# Altium schematic sheet MSP_Telemetry.SchDoc
size A4; Organization: Creotech Instruments; Address1: Gen. L. Okulickiego 7/9; Address2: 05-500 Piaseczno; Address3: Poland
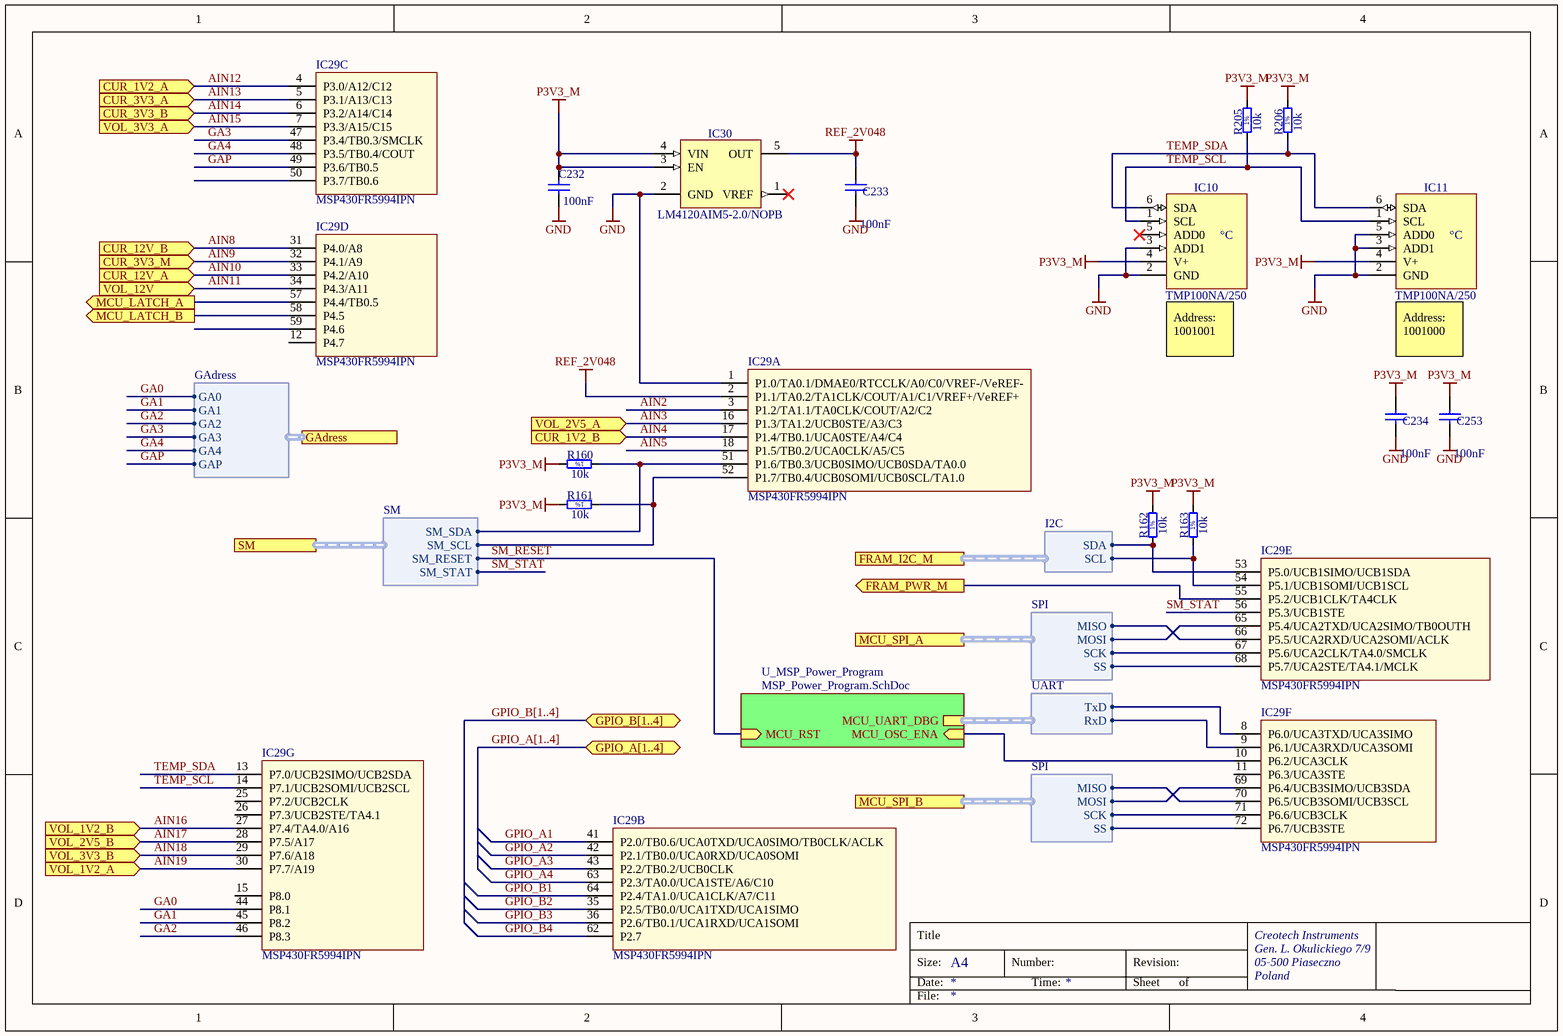
[diagram p0: MSP_Telemetry.SchDoc]

## Parts
C232  100nF  [CAPC1608X87N]
C233  100nF  [CAPC1608X87N]
C234  100nF  [CAPC1608X87N]
C253  100nF  [CAPC1608X87N]
IC10  TMP100NA/250  [SOT95P280X145-6N]
IC11  TMP100NA/250  [SOT95P280X145-6N]
IC29  MSP430FR5994IPN  [PQFP50P1400X1400-80N]  (parts A,B,C,D,E,F,G of 9)
IC30  LM4120AIM5-2.0/NOPB  [SOT95P280X145-5N]
R160  10k  [RESC1608X55N]
R161  10k  [RESC1608X55N]
R162  10k  [RESC1608X55N]
R163  10k  [RESC1608X55N]
R205  10k  [RESC1608X55N]
R206  10k  [RESC1608X55N]

## Sub-sheets
U_MSP_Power_Program = MSP_Power_Program.SchDoc: MCU_OSC_ENA (in), MCU_UART_DBG (harness UART), MCU_RST (in)

## Ports
CUR_1V2_A (in), CUR_1V2_B (in), CUR_3V3_A (in), CUR_3V3_B (in), CUR_3V3_M (in), CUR_12V_A (in), CUR_12V_B (in), FRAM_I2C_M (harness I2C), FRAM_PWR_M (out), GAdress (harness GAdress), GPIO_A[1..4] (bidir), GPIO_B[1..4] (bidir), MCU_LATCH_A (out), MCU_LATCH_B (out), MCU_SPI_A (harness SPI), MCU_SPI_B (harness SPI), SM (harness SM), VOL_1V2_A (in), VOL_1V2_B (in), VOL_2V5_A (in), VOL_2V5_B (in), VOL_3V3_A (in), VOL_3V3_B (in), VOL_12V (in)

## Harnesses
I2C: SDA, SCL
SPI: MISO, MOSI, SCK, SS
UART: TxD, RxD
SM: SM_SCL, SM_SDA, SM_RESET, SM_STAT
GAdress: GA0, GA1, GA2, GA3, GA4, GAP

## Nets
GND: C232.1 C233.1 C234.1 C253.1 IC10.2(GND) IC10.3(ADD1) IC11.2(GND) IC11.3(ADD1) IC11.5(ADD0) IC29.1(P1.0/TA0.1/DMAE0/RTCCLK/A0/C0/VREF-/VeREF-) IC30.2(GND)
P3V3_M: C232.2 C234.2 C253.2 IC10.4(V+) IC11.4(V+) IC30.3(EN) IC30.4(VIN) R160.2 R161.2 R162.2 R163.2 R205.2 R206.2
REF_2V048: C233.2 IC29.2(P1.1/TA0.2/TA1CLK/COUT/A1/C1/VREF+/VeREF+) IC30.5(OUT)
AIN2: IC29.3(P1.2/TA1.1/TA0CLK/COUT/A2/C2)
AIN3: IC29.16(P1.3/TA1.2/UCB0STE/A3/C3) ; port VOL_2V5_A
AIN4: IC29.17(P1.4/TB0.1/UCA0STE/A4/C4) ; port CUR_1V2_B
AIN5: IC29.18(P1.5/TB0.2/UCA0CLK/A5/C5)
AIN8: IC29.31(P4.0/A8) ; port CUR_12V_B
AIN9: IC29.32(P4.1/A9) ; port CUR_3V3_M
AIN10: IC29.33(P4.2/A10) ; port CUR_12V_A
AIN11: IC29.34(P4.3/A11) ; port VOL_12V
AIN12: IC29.4(P3.0/A12/C12) ; port CUR_1V2_A
AIN13: IC29.5(P3.1/A13/C13) ; port CUR_3V3_A
AIN14: IC29.6(P3.2/A14/C14) ; port CUR_3V3_B
AIN15: IC29.7(P3.3/A15/C15) ; port VOL_3V3_A
AIN16: IC29.27(P7.4/TA4.0/A16) ; port VOL_1V2_B
AIN17: IC29.28(P7.5/A17) ; port VOL_2V5_B
AIN18: IC29.29(P7.6/A18) ; port VOL_3V3_B
AIN19: IC29.30(P7.7/A19) ; port VOL_1V2_A
FRAM_PWR_M: IC29.55(P5.2/UCB1CLK/TA4CLK) ; port FRAM_PWR_M
GA0: IC29.44(P8.1) ; port GAdress.GA0
GA1: IC29.45(P8.2) ; port GAdress.GA1
GA2: IC29.46(P8.3) ; port GAdress.GA2
GA3: IC29.47(P3.4/TB0.3/SMCLK) ; port GAdress.GA3
GA4: IC29.48(P3.5/TB0.4/COUT) ; port GAdress.GA4
GAP: IC29.49(P3.6/TB0.5) ; port GAdress.GAP
GPIO_A1: IC29.41(P2.0/TB0.6/UCA0TXD/UCA0SIMO/TB0CLK/ACLK)
GPIO_A2: IC29.42(P2.1/TB0.0/UCA0RXD/UCA0SOMI)
GPIO_A3: IC29.43(P2.2/TB0.2/UCB0CLK)
GPIO_A4: IC29.63(P2.3/TA0.0/UCA1STE/A6/C10)
GPIO_B1: IC29.64(P2.4/TA1.0/UCA1CLK/A7/C11)
GPIO_B2: IC29.35(P2.5/TB0.0/UCA1TXD/UCA1SIMO)
GPIO_B3: IC29.36(P2.6/TB0.1/UCA1RXD/UCA1SOMI)
GPIO_B4: IC29.62(P2.7)
MCU_LATCH_A: IC29.57(P4.4/TB0.5) ; port MCU_LATCH_A
MCU_LATCH_B: IC29.58(P4.5) ; port MCU_LATCH_B
SM_RESET: sheet U_MSP_Power_Program/MCU_RST, port SM.SM_RESET
SM_STAT: IC29.56(P5.3/UCB1STE) ; port SM.SM_STAT
TEMP_SCL: IC10.1(SCL) IC11.1(SCL) IC29.14(P7.1/UCB2SOMI/UCB2SCL) R205.1
TEMP_SDA: IC10.6(SDA) IC11.6(SDA) IC29.13(P7.0/UCB2SIMO/UCB2SDA) R206.1
NetIC29_8: IC29.8(P6.0/UCA3TXD/UCA3SIMO) ; sheet U_MSP_Power_Program/MCU_UART_DBG.TxD
NetIC29_9: IC29.9(P6.1/UCA3RXD/UCA3SOMI) ; sheet U_MSP_Power_Program/MCU_UART_DBG.RxD
NetIC29_10: IC29.10(P6.2/UCA3CLK) ; sheet U_MSP_Power_Program/MCU_OSC_ENA
NetIC29_51: IC29.51(P1.6/TB0.3/UCB0SIMO/UCB0SDA/TA0.0) R160.1 ; port SM.SM_SDA
NetIC29_52: IC29.52(P1.7/TB0.4/UCB0SOMI/UCB0SCL/TA1.0) R161.1 ; port SM.SM_SCL
NetIC29_53: IC29.53(P5.0/UCB1SIMO/UCB1SDA) R162.1 ; port FRAM_I2C_M.SDA
NetIC29_54: IC29.54(P5.1/UCB1SOMI/UCB1SCL) R163.1 ; port FRAM_I2C_M.SCL
NetIC29_65: IC29.65(P5.4/UCA2TXD/UCA2SIMO/TB0OUTH) ; port MCU_SPI_A.MOSI
NetIC29_66: IC29.66(P5.5/UCA2RXD/UCA2SOMI/ACLK) ; port MCU_SPI_A.MISO
NetIC29_67: IC29.67(P5.6/UCA2CLK/TA4.0/SMCLK) ; port MCU_SPI_A.SCK
NetIC29_68: IC29.68(P5.7/UCA2STE/TA4.1/MCLK) ; port MCU_SPI_A.SS
NetIC29_69: IC29.69(P6.4/UCB3SIMO/UCB3SDA) ; port MCU_SPI_B.MOSI
NetIC29_70: IC29.70(P6.5/UCB3SOMI/UCB3SCL) ; port MCU_SPI_B.MISO
NetIC29_71: IC29.71(P6.6/UCB3CLK) ; port MCU_SPI_B.SCK
NetIC29_72: IC29.72(P6.7/UCB3STE) ; port MCU_SPI_B.SS

Not connected (* = marked no-connect by the designer): IC10 5(ADD0)*; IC29 11(P6.3/UCA3STE) 12(P4.7) 15(P8.0) 25(P7.2/UCB2CLK) 26(P7.3/UCB2STE/TA4.1) 50(P3.7/TB0.6) 59(P4.6); IC30 1(VREF)*

## Buses and harness runs
bus GPIO_A[1..4] = port GPIO_A[1..4]
bus GPIO_B[1..4] = port GPIO_B[1..4]

## Notes on the sheet
- (near IC10) Address: 1001001
- (near IC11) Address: 1001000
- Title
- Size:
- Date:
- A4
- Number:
- Time:
- Revision:
- Sheet
- of
- File:
- (in symbol R0603_10K_1%_0.1W_100PPM) 1%
- (in symbol TMP100NA/250) °C

## Library data of the parts
C232-C234 C253 = CC0603_100NF_50V_10%_X7R: Non-polarised capacitor; Part Description: SMD Multilayer Chip Ceramic Capacitor; Manufacturer: GENERIC; Manufacturer1 Part Number: 223858615649; Voltage: 50V; TC: X7R; Tolerance: ±10%; Part Number: CC0603_100NF_50V_10%_X7R; Component Kind: Standard; Component Type: Standard; Pin Count: 2; Value: 100nF; Status: Preferred; Manufacturer Part Number: CC0603_100NF_50V_10%_X7R; Case: 0603; Mounted: Yes; Socket: No; SMD: Yes; Sense: No; Manufacturer1 Example: PHYCOMP; Manufacturer1 ComponentHeight: 0.87mm; HelpURL: \\cern.ch\dfs\Applications\Altium\Datasheets\CC0603_X7R_PHYCOMP.pdf; Author: CERN DEM JLC; CreateDate: 2007-12-03; LatestRevisionDate: 2007-12-03
IC10 IC11 = TMP100NA/250: Digital Temperature Sensor with I2C Interface; Part Description: -55°C to +125°C, ±3.0°C Accuracy, Digital Temperature Sensor with I2C Interface; Manufacturer: TEXAS INSTRUMENTS; PressFit: No; Bonding: No; Part Number: TMP100NA/250; Component Kind: Standard; Component Type: Standard; Device: TMP100NA/250; PackageDescription: SOT23, 6-Leads, Body 1.6x3.0mm, Pitch 0.95mm, IPC Medium Density; Manufacturer Part Number: TMP100NA/250; Pin Count: 6; Case: SOT23-6; Mounted: Yes; Socket: No; SMD: Yes; Sense: No; ComponentHeight: 1.45mm; HelpURL: \\cern.ch\dfs\Applications\Altium\Datasheets\TMP100NA-250.pdf; Author: CERN DEM JLC; CreateDate: 29.10.2012; LatestRevisionDate: 29.10.2012
IC29 = UPC_MSP430FR5994IPN: Manufacturer: TI; Part Description: FRAM microcontroller; Bonding: No; ComponentHeigth: 2mm; PressFit: No; Case: LQFP80; Component Kind: Standard; Component Type: Standard; CreateDate: 2018-01-01; Device: MSP430FR5994IPN; Footprint: LQFP80; HelpURL: *; LatestRevisionDate: 2018-01-01; Manufacturer Part Number: MSP430FR5994IPN; Mounted: Yes; PackageDescription: LQFP80; Part Number: MSP430FR5994IPN; Pin Count: 80; Sense: No; SMD: Yes; Socket: No; Value: *
IC30 = LM4120AIM5-2.0/NOPB: Precision Micropower Low Dropout Voltage Reference; Part Description: 2.048V Precision Micropower Low Dropout Voltage Reference; Manufacturer: TEXAS INSTRUMENTS; PressFit: No; Bonding: No; Part Number: LM4120AIM5-2.0/NOPB; Component Kind: Standard; Component Type: Standard; Device: LM4120AIM5-2.0/NOPB; PackageDescription: SOT, 0.95mm Pitch; 5 Pin, 1.60mm W X 2.90mm L X 1.45mm H Body, IPC Medium Density; Manufacturer Part Number: LM4120AIM5-2.0/NOPB; Pin Count: 5; Case: SOT23-5; Mounted: Yes; Socket: No; SMD: Yes; Sense: No; ComponentHeight: 1.45mm; HelpURL: \\cern.ch\dfs\Applications\Altium\Datasheets\LM4120AIM5-2.0-NOPB.pdf; Author: CERN DEM JMW; CreateDate: 2016-08-31; LatestRevisionDate: 2016-08-31
R160-R163 R205 R206 = R0603_10K_1%_0.1W_100PPM: Resistor - 1%; Part Description: General Purpose Thick Film Chip Resistor; Manufacturer: GENERIC; Manufacturer1 Part Number: NRC06F1002TRF; Power: 0.1W; TC: ±100ppm/°C; PressFit: No; Part Number: R0603_10K_1%_0.1W_100PPM; Component Kind: Standard; Component Type: Standard; Pin Count: 2; Value: 10k; Status: Preferred; Tolerance: ±1%; Manufacturer Part Number: R0603_10K_1%_0.1W_100PPM; Case: 0603; Mounted: Yes; Sense: No; Socket: No; SMD: Yes; Manufacturer1 Example: NIC COMPONENT; Manufacturer1 ComponentHeight: 0.55mm; HelpURL: \\cern.ch\dfs\Applications\Altium\Datasheets\R0603_NIC_NRC.pdf; Author: CERN DEM JLC; CreateDate: 2007-12-03; LatestRevisionDate: 2008-03-13